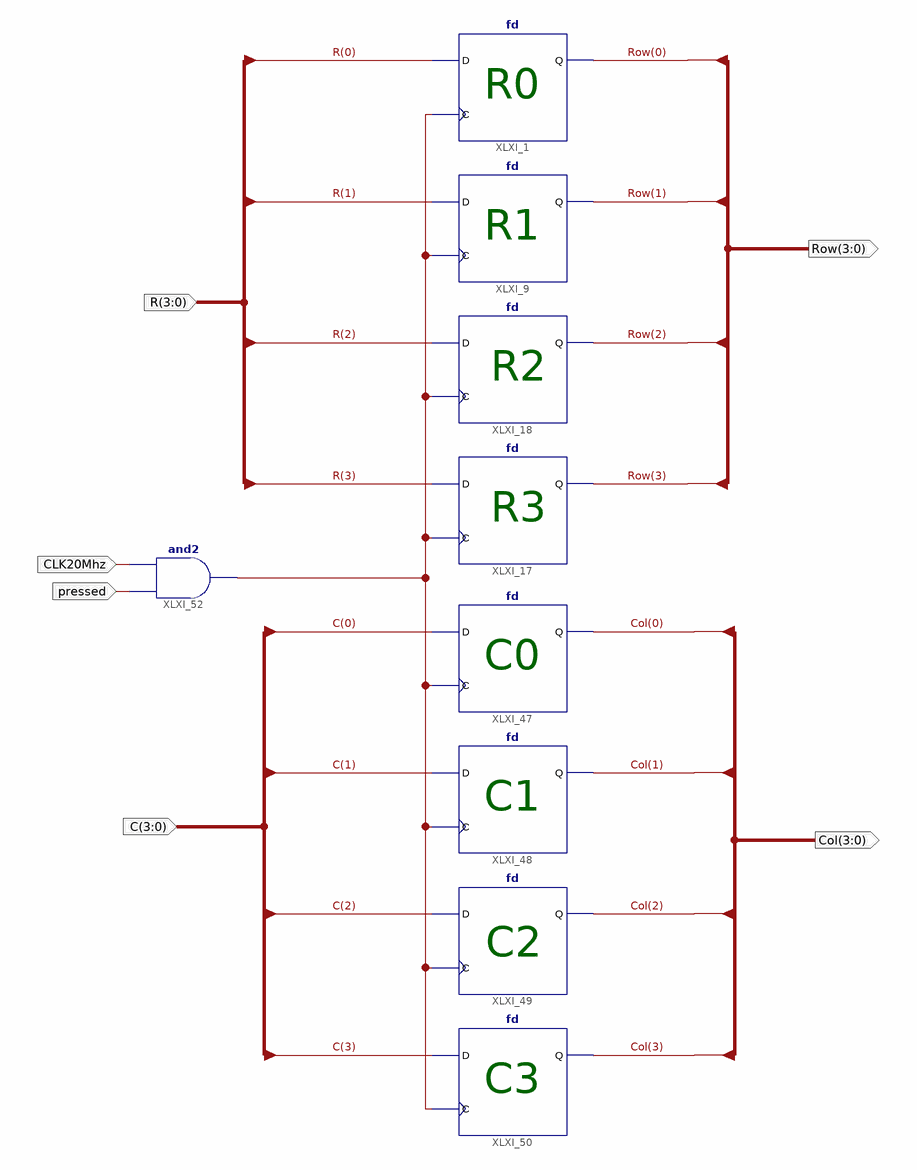
[diagram p0: schematic sheet 1]
// Xilinx ISE schematic numbuf.sch (spartan6) as structural Verilog: 9 symbols, 6 ports
module numbuf (
  input  CLK20Mhz,
  input  pressed,
  input  [3:0] R,
  input  [3:0] C,
  output [3:0] Row,
  output [3:0] Col
);

  wire XLXN_32;

  fd XLXI_1 (.C(XLXN_32), .D(R[0]), .Q(Row[0]));
  fd XLXI_9 (.C(XLXN_32), .D(R[1]), .Q(Row[1]));
  fd XLXI_18 (.C(XLXN_32), .D(R[2]), .Q(Row[2]));
  fd XLXI_17 (.C(XLXN_32), .D(R[3]), .Q(Row[3]));
  fd XLXI_47 (.C(XLXN_32), .D(C[0]), .Q(Col[0]));
  fd XLXI_48 (.C(XLXN_32), .D(C[1]), .Q(Col[1]));
  fd XLXI_49 (.C(XLXN_32), .D(C[2]), .Q(Col[2]));
  fd XLXI_50 (.C(XLXN_32), .D(C[3]), .Q(Col[3]));
  and XLXI_52 (XLXN_32, pressed, CLK20Mhz);

  // Notes on the sheet:
  //   R0
  //   R1
  //   R2
  //   R3
  //   C0
  //   C1
  //   C2
  //   C3
endmodule
